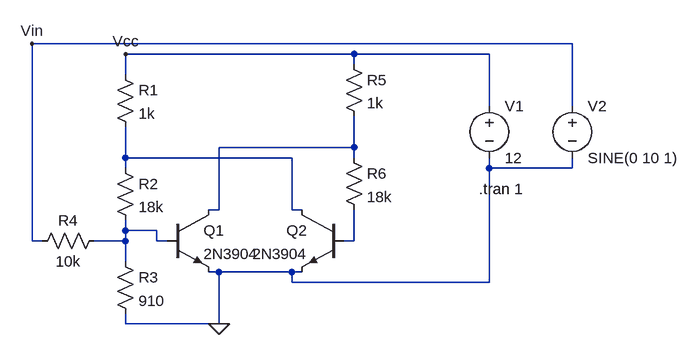
[diagram p0: schematic schmitt_trigger_bjts.asc]
schmitt_trigger_bjts.asc, the LTspice schematic file:
Version 4.1
SHEET 1 880 680
WIRE 80 352 96 352
WIRE 224 352 208 352
WIRE -48 416 -48 432
WIRE 512 176 512 192
WIRE 640 176 640 192
WIRE 96 352 208 352
WIRE 96 352 96 432
WIRE 96 432 -48 432
WIRE 208 352 208 368
WIRE 208 368 512 368
WIRE 512 368 512 192
WIRE 512 192 640 192
FLAG 96 432 0
WIRE 80 256 96 256
WIRE 304 112 304 128
WIRE 304 176 304 160
WIRE 96 256 96 160
WIRE 96 160 304 160
WIRE 304 160 304 128
WIRE 224 256 208 256
WIRE -48 128 -48 144
WIRE -48 192 -48 176
WIRE 208 256 208 176
WIRE 208 176 -48 176
WIRE -48 176 -48 144
WIRE 16 304 0 304
WIRE -48 272 -48 288
WIRE -48 336 -48 320
WIRE -96 304 -80 304
WIRE 0 304 0 288
WIRE 0 288 -48 288
WIRE -48 288 -48 320
WIRE -48 288 -48 304
WIRE -48 304 -80 304
WIRE 288 304 304 304
WIRE 304 256 304 272
WIRE 304 304 304 272
WIRE -48 48 -48 32
WIRE 304 32 304 16
WIRE 512 96 512 80
WIRE -48 32 -48 16
WIRE -48 16 304 16
WIRE 304 16 512 16
WIRE 512 16 512 80
FLAG -48 16 Vcc
WIRE -176 304 -192 304
WIRE 640 96 640 80
WIRE -192 304 -192 0
WIRE -192 0 640 0
WIRE 640 0 640 80
FLAG -192 0 Vin
SYMBOL res -64 32 R0
SYMATTR InstName R1
SYMATTR Value 1k
SYMBOL res -64 176 R0
SYMATTR InstName R2
SYMATTR Value 18k
SYMBOL res -64 320 R0
SYMATTR InstName R3
SYMATTR Value 910
SYMBOL res -80 288 R90
WINDOW 0 0 56 VBottom 2
WINDOW 3 32 56 VTop 2
SYMATTR InstName R4
SYMATTR Value 10k
SYMBOL res 288 16 R0
SYMATTR InstName R5
SYMATTR Value 1k
SYMBOL res 288 160 R0
SYMATTR InstName R6
SYMATTR Value 18k
SYMBOL npn 16 256 R0
SYMATTR InstName Q1
SYMATTR Value 2N3904
SYMBOL npn 288 256 M0
SYMATTR InstName Q2
SYMATTR Value 2N3904
SYMBOL voltage 512 80 R0
WINDOW 123 0 0 Left 2
WINDOW 39 0 0 Left 2
SYMATTR InstName V1
SYMATTR Value 12
SYMBOL voltage 640 80 R0
WINDOW 123 0 0 Left 2
WINDOW 39 0 0 Left 2
SYMATTR InstName V2
SYMATTR Value SINE(0 10 1)
TEXT 496 224 Left 2 !.tran 1

The netlist it stands for:
* schmitt_trigger_bjts.asc
R1 Vcc N002 1k
R2 N002 N003 18k
R3 N003 0 910
R4 N003 Vin 10k
R5 Vcc N001 1k
R6 N001 N004 18k
Q1 N001 N003 0 0 2N3904
Q2 N002 N004 0 0 2N3904
V1 Vcc 0 12
V2 Vin 0 SINE(0 10 1)
.model NPN NPN
.model PNP PNP
.lib standard.bjt
.tran 1
.backanno
.end